# EAGLE schematic twip-pb1A-mirror (EAGLE 9.2.1)
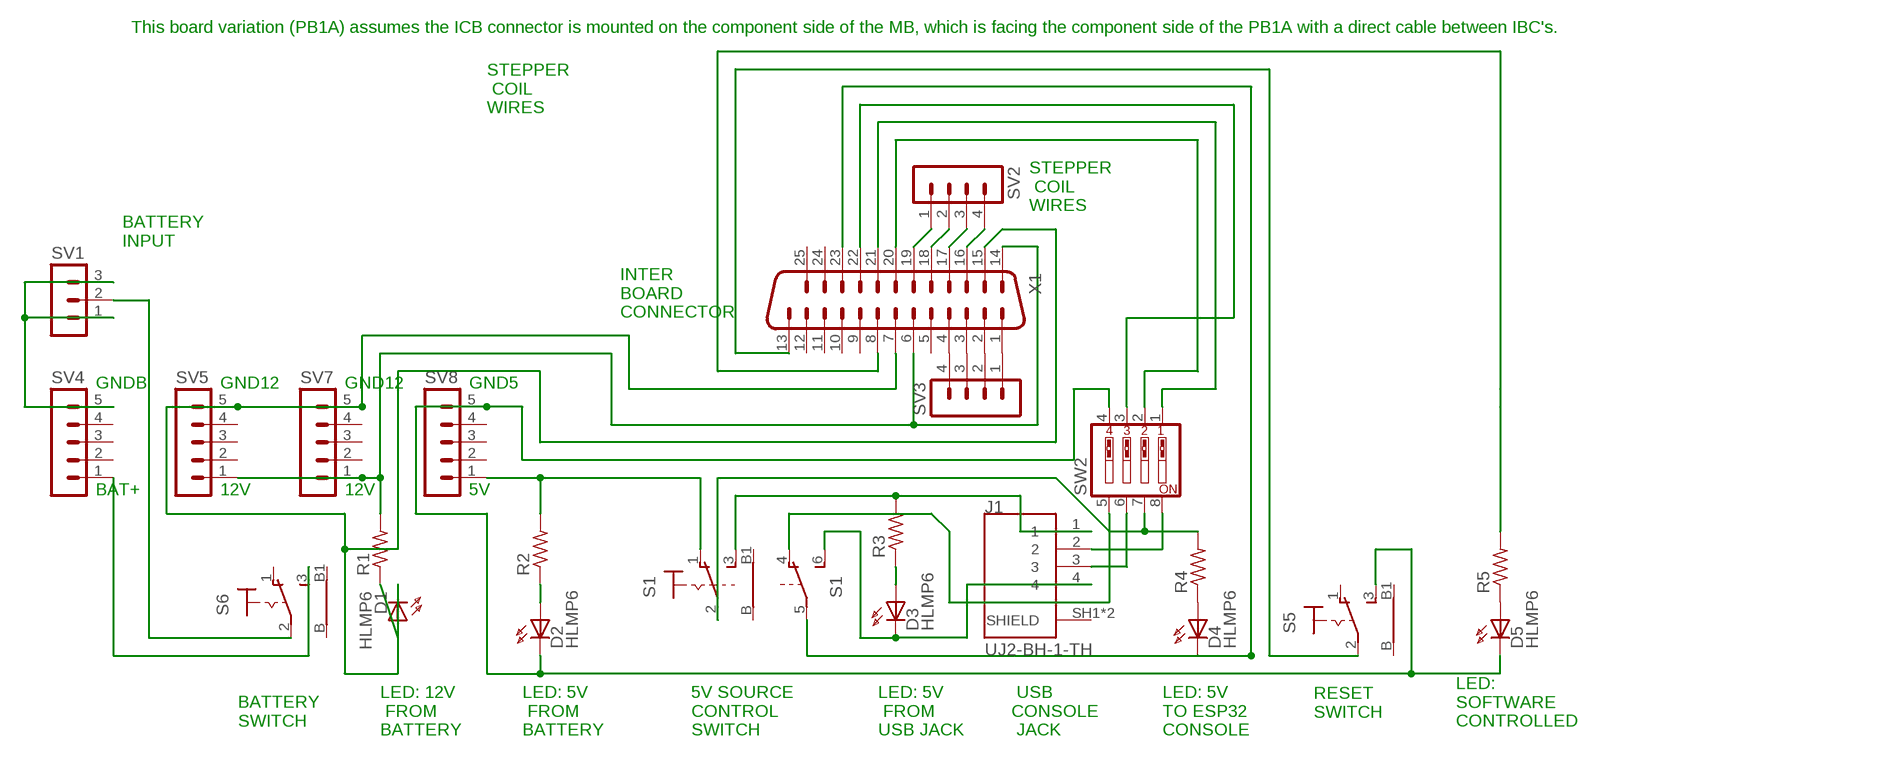
[diagram p0: schematic, sheet 1]

## Parts
D1  HLMP6  [HLMP6]
D2  HLMP6  [HLMP6]
D3  HLMP6  [HLMP6]
D4  HLMP6  [HLMP6]
D5  HLMP6  [HLMP6]
J1  UJ2-BH-1-TH  [CUI_UJ2-BH-1-TH]
R1  R-US_0207/5V  [0207/5V]
R2  R-US_0207/5V  [0207/5V]
R3  R-US_0207/5V  [0207/5V]
R4  R-US_0207/5V  [0207/5V]
R5  R-US_0207/5V  [0207/5V]
S1  9070-2W  [9070-2W]
S5  9070-1W  [9070-1W]
S6  9070-1W  [9070-1W]
SV1  MA03-1  [MA03-1]
SV2  MA04-1  [MA04-1]
SV3  MA04-1  [MA04-1]
SV4  MA05-1  [MA05-1]
SV5  MA05-1  [MA05-1]
SV7  MA05-1  [MA05-1]
SV8  MA05-1  [MA05-1]
SW2  SW_DIP-4  [EDG-04]
X1  M25VP  [M25VP]

## Nets
N$1: D1.A R1.1
N$2: D2.A R2.1
N$3: D3.A R3.1
N$4: D4.A R4.1
N$5: D5.A R5.1
N$6: SV1.1 SV1.3 SV4.5
N$7: S6.2(P) SV1.2
N$8: R1.2 SV5.1 SV7.1 X1.6 X1.14
N$9: J1.1 R3.2 S1.3(1:S)
N$10: S6.3(S) SV4.1
N$11: SV2.1 X1.19
N$12: R2.2 S1.1(1:O) SV8.1
N$13: J1.2 SW2.8
N$14: SV3.4 X1.4
N$15: SV3.3 X1.3
N$16: SV3.2 X1.2
N$17: SV3.1 X1.1
N$18: SV2.2 X1.18
N$19: SV2.3 X1.17
N$20: SV2.4 X1.16
N$21: R5.2 X1.8
N$22: R4.2 S1.2(1:P) SW2.7
N$23: D3.K J1.4 S1.6(B:S)
N$24: SW2.1 X1.21
N$25: SW2.3 X1.22
N$26: SW2.2 X1.20
N$27: D4.K S1.5(B:P) X1.23
N$28: S5.2(P) X1.13
N$29: D1.K SV5.5 SV7.5 X1.7 X1.15
N$30: S1.4(B:O) SW2.5
N$31: D2.K D5.K S5.3(S) SV8.5 SW2.4
N$33: J1.3 SW2.6
Unconnected: J1.SH1(SHIELD) J1.SH2(SHIELD) S1.B1(1:B1) S1.B(1:B) S5.1(O) S5.B S5.B1 S6.1(O) S6.B S6.B1 SV4.2 SV4.3 SV4.4 SV5.2 SV5.3 SV5.4 SV7.2 SV7.3 SV7.4 SV8.2 SV8.3 SV8.4 X1.5 X1.9 X1.10 X1.11 X1.12 X1.24 X1.25 X1.G1 X1.G2

## Notes on the sheet
- This board variation (PB1A) assumes the ICB connector is mounted on the component side of the MB, which is facing the component side of the PB1A with a direct cable between IBC's.
- STEPPER
   COIL
  WIRES
- STEPPER
   COIL
  WIRES
- BATTERY
  INPUT
- INTER 
  BOARD 
  CONNECTOR
- GNDB | GND12 | GND12 | GND5
- BAT+ | 12V | 12V | 5V
- RESET
  SWITCH
- BATTERY 
  SWITCH
- LED: 
  SOFTWARE
  CONTROLLED
- LED: 12V
   FROM
  BATTERY
- LED: 5V
   FROM
  BATTERY
- 5V SOURCE
  CONTROL
  SWITCH
- LED: 5V
   FROM
  USB JACK
- USB
  CONSOLE
   JACK
- LED: 5V
  TO ESP32
  CONSOLE

## Library data of the parts
D1-D5 = display-hp:HLMP6: LED 2mm horizontal; MF: AGILENT TECHNOLOGIES; MPN: HLMP-6500; OC_FARNELL: 1652490; OC_NEWARK: 40K0088
J1 = UJ2-BH-1-TH:UJ2-BH-1-TH: 3 µin Plating Thickness, Black Insulator, USB Receptacle; MANUFACTURER: CUI INC; PART_REV: 1.0; STANDARD: MANUFACTURER RECOMENDATION
R1-R5 = resistor:R-US_: RESISTOR, American symbol
S1 = switch:9070-2W: TOGGLE SWITCH Marquardt
S5 S6 = switch:9070-1W: TOGGLE SWITCH Marquardt
SV1 = con-lstb:MA03-1: PIN HEADER; OC_FARNELL: unknown; OC_NEWARK: unknown
SV2 SV3 = con-lstb:MA04-1: PIN HEADER; OC_FARNELL: unknown; OC_NEWARK: unknown
SV4 SV5 SV7 SV8 = con-lstb:MA05-1: PIN HEADER; OC_FARNELL: unknown; OC_NEWARK: unknown
SW2 = special:SW_DIP-4: DIP SWITCH
X1 = con-subd:M25VP: SUB-D; OC_FARNELL: unknown; OC_NEWARK: unknown